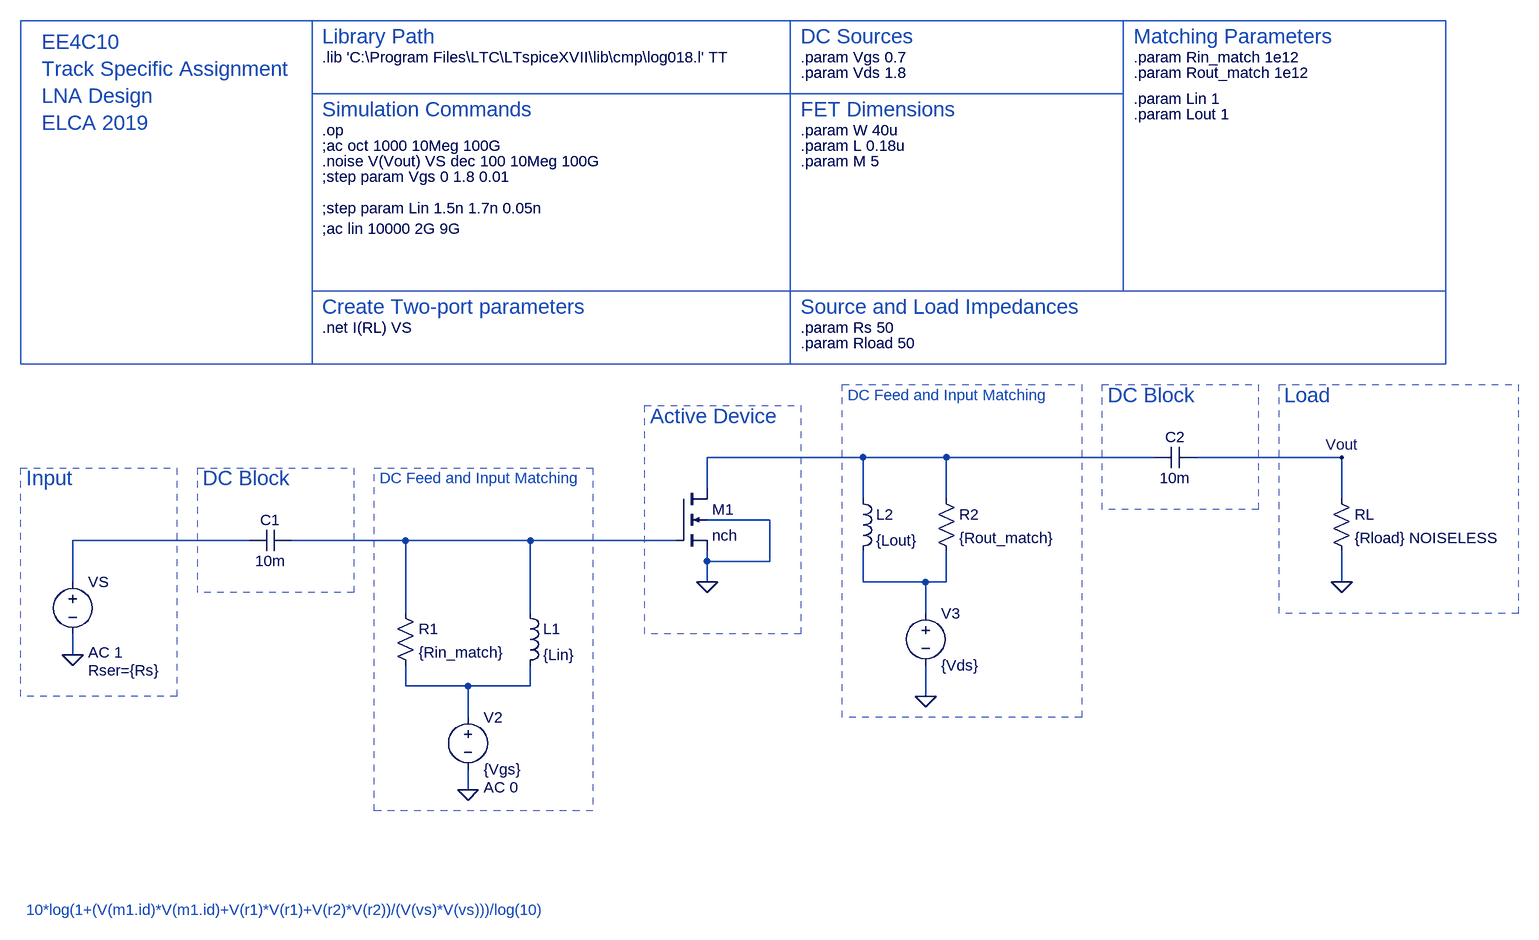
[diagram p0: schematic EE4C10_RF_LNA_shunts_student_2021.asc]
EE4C10_RF_LNA_shunts_student_2021.asc, the LTspice schematic file:
Version 4
SHEET 1 2932 948
WIRE 368 64 128 64
WIRE 496 64 368 64
WIRE 816 64 496 64
WIRE 1104 64 880 64
WIRE 128 112 128 64
WIRE 368 128 368 64
WIRE 496 128 496 64
WIRE 1104 128 1104 64
WIRE 224 160 128 160
WIRE -576 192 -848 192
WIRE -336 192 -512 192
WIRE -144 192 -336 192
WIRE 80 192 -144 192
WIRE 128 224 128 208
WIRE 224 224 224 160
WIRE 224 224 128 224
WIRE -848 256 -848 192
WIRE 128 256 128 224
WIRE 368 256 368 208
WIRE 464 256 368 256
WIRE 496 256 496 208
WIRE 496 256 464 256
WIRE 1104 256 1104 208
WIRE -336 304 -336 192
WIRE -144 304 -144 192
WIRE 464 304 464 256
WIRE -848 368 -848 336
WIRE -336 416 -336 384
WIRE -240 416 -336 416
WIRE -144 416 -144 384
WIRE -144 416 -240 416
WIRE 464 432 464 384
WIRE -240 464 -240 416
WIRE -240 576 -240 544
FLAG -848 368 0
FLAG -240 576 0
FLAG 128 256 0
FLAG 464 432 0
FLAG 1104 256 0
FLAG 1104 64 Vout
SYMBOL voltage -848 240 R0
WINDOW 123 24 124 Left 2
WINDOW 39 24 152 Left 2
SYMATTR Value2 AC 1
SYMATTR SpiceLine Rser={Rs}
SYMATTR InstName VS
SYMATTR Value ""
SYMBOL cap -512 176 R90
WINDOW 0 0 32 VBottom 2
WINDOW 3 32 32 VTop 2
SYMATTR InstName C1
SYMATTR Value 10m
SYMBOL res -352 288 R0
SYMATTR InstName R1
SYMATTR Value {Rin_match}
SYMBOL ind -160 288 R0
SYMATTR InstName L1
SYMATTR Value {Lin}
SYMBOL voltage -240 448 R0
WINDOW 123 24 124 Left 2
WINDOW 39 0 0 Left 0
SYMATTR Value2 AC 0
SYMATTR InstName V2
SYMATTR Value {Vgs}
SYMBOL nmos4 80 112 R0
SYMATTR InstName M1
SYMATTR Value nch
SYMATTR Value2 l={L} w={W} m={M}
SYMBOL ind 352 112 R0
SYMATTR InstName L2
SYMATTR Value {Lout}
SYMBOL res 480 112 R0
SYMATTR InstName R2
SYMATTR Value {Rout_match}
SYMBOL voltage 464 288 R0
SYMATTR InstName V3
SYMATTR Value {Vds}
SYMBOL res 1088 112 R0
SYMATTR InstName RL
SYMATTR Value {Rload} NOISELESS
SYMBOL cap 880 48 R90
WINDOW 0 0 32 VBottom 2
WINDOW 3 32 32 VTop 2
SYMATTR InstName C2
SYMATTR Value 10m
TEXT -464 -552 Left 2 !.lib 'C:\\Program Files\\LTC\\LTspiceXVII\\lib\\cmp\\log018.l' TT
TEXT 272 -136 Left 2 !.param Rs 50
TEXT 784 -552 Left 2 !.param Rin_match 1e12
TEXT 784 -488 Left 2 !.param Lin 1
TEXT 272 -552 Left 2 !.param Vgs 0.7
TEXT 272 -440 Left 2 !.param W 40u
TEXT 272 -416 Left 2 !.param L 0.18u
TEXT 272 -528 Left 2 !.param Vds 1.8
TEXT 784 -464 Left 2 !.param Lout 1
TEXT 784 -528 Left 2 !.param Rout_match 1e12
TEXT -464 -440 Left 2 !.op
TEXT 272 -112 Left 2 !.param Rload 50
TEXT 272 -392 Left 2 !.param M 5
TEXT -464 -368 Left 2 !;step param Vgs 0 1.8 0.01
TEXT -464 -416 Left 2 !;ac oct 1000 10Meg 100G
TEXT -464 -136 Left 2 !.net I(RL) VS
TEXT -464 -168 Left 3 ;Create Two-port parameters
TEXT -464 -584 Left 3 ;Library Path
TEXT -464 -472 Left 3 ;Simulation Commands
TEXT 272 -584 Left 3 ;DC Sources
TEXT 272 -472 Left 3 ;FET Dimensions
TEXT 272 -168 Left 3 ;Source and Load Impedances
TEXT 784 -584 Left 3 ;Matching Parameters
TEXT -920 96 Left 3 ;Input
TEXT -648 96 Left 3 ;DC Block
TEXT 744 -32 Left 3 ;DC Block
TEXT -376 96 Left 2 ;DC Feed and Input Matching
TEXT 344 -32 Left 2 ;DC Feed and Input Matching
TEXT 40 0 Left 3 ;Active Device
TEXT 1016 -32 Left 3 ;Load
TEXT -896 -576 Left 3 ;EE4C10\nTrack Specific Assignment\nLNA Design\nELCA 2019
TEXT -464 -392 Left 2 !.noise V(Vout) VS dec 100 10Meg 100G
TEXT -464 -320 Left 2 !;step param Lin 1.5n 1.7n 0.05n
TEXT -464 -288 Left 2 !;ac lin 10000 2G 9G
TEXT -920 760 Left 2 ;10*log(1+(V(m1.id)*V(m1.id)+V(r1)*V(r1)+V(r2)*V(r2))/(V(vs)*V(vs)))/log(10)
RECTANGLE Normal 768 -496 256 -608
RECTANGLE Normal 768 -192 256 -496
RECTANGLE Normal 1264 -80 256 -192
RECTANGLE Normal 1264 -192 768 -608
RECTANGLE Normal 256 -608 -480 -496
RECTANGLE Normal 256 -192 -480 -496
RECTANGLE Normal -480 -80 256 -192
RECTANGLE Normal -688 432 -928 80 2
RECTANGLE Normal -48 608 -384 80 2
RECTANGLE Normal -416 272 -656 80 2
RECTANGLE Normal 976 144 736 -48 2
RECTANGLE Normal 704 464 336 -48 2
RECTANGLE Normal 272 336 32 -16 2
RECTANGLE Normal 1376 304 1008 -48 2
RECTANGLE Normal -928 -80 -480 -608

The netlist it stands for:
* EE4C10_RF_LNA_shunts_student_2021.asc
VS N002 0 AC 1 Rser={Rs}
C1 N003 N002 10m
R1 N003 N005 {Rin_match}
L1 N003 N005 {Lin}
V2 N005 0 {Vgs} AC 0
M1 N001 N003 0 0 nch l={L} w={W} m={M}
L2 N001 N004 {Lout}
R2 N001 N004 {Rout_match}
V3 N004 0 {Vds}
RL Vout 0 {Rload} NOISELESS
C2 Vout N001 10m
.model NMOS NMOS
.model PMOS PMOS
.lib standard.mos
.lib 'C:\Program Files\LTC\LTspiceXVII\lib\cmp\log018.l' TT
.param Rs 50
.param Rin_match 1e12
.param Lin 1
.param Vgs 0.7
.param W 40u
.param L 0.18u
.param Vds 1.8
.param Lout 1
.param Rout_match 1e12
.op
.param Rload 50
.param M 5
;step param Vgs 0 1.8 0.01
;ac oct 1000 10Meg 100G
.net I(RL) VS
* Create Two-port parameters
* Library Path
* Simulation Commands
* DC Sources
* FET Dimensions
* Source and Load Impedances
* Matching Parameters
* Input
* DC Block
* DC Block
* DC Feed and Input Matching
* DC Feed and Input Matching
* Active Device
* Load
* EE4C10
* Track Specific Assignment
* LNA Design
* ELCA 2019
.noise V(Vout) VS dec 100 10Meg 100G
;step param Lin 1.5n 1.7n 0.05n
;ac lin 10000 2G 9G
* 10*log(1+(V(m1.id)*V(m1.id)+V(r1)*V(r1)+V(r2)*V(r2))/(V(vs)*V(vs)))/log(10)
.backanno
.end